# EAGLE design dashboard_controller (EAGLE 9.5.1)

## Sheet 1 of 2
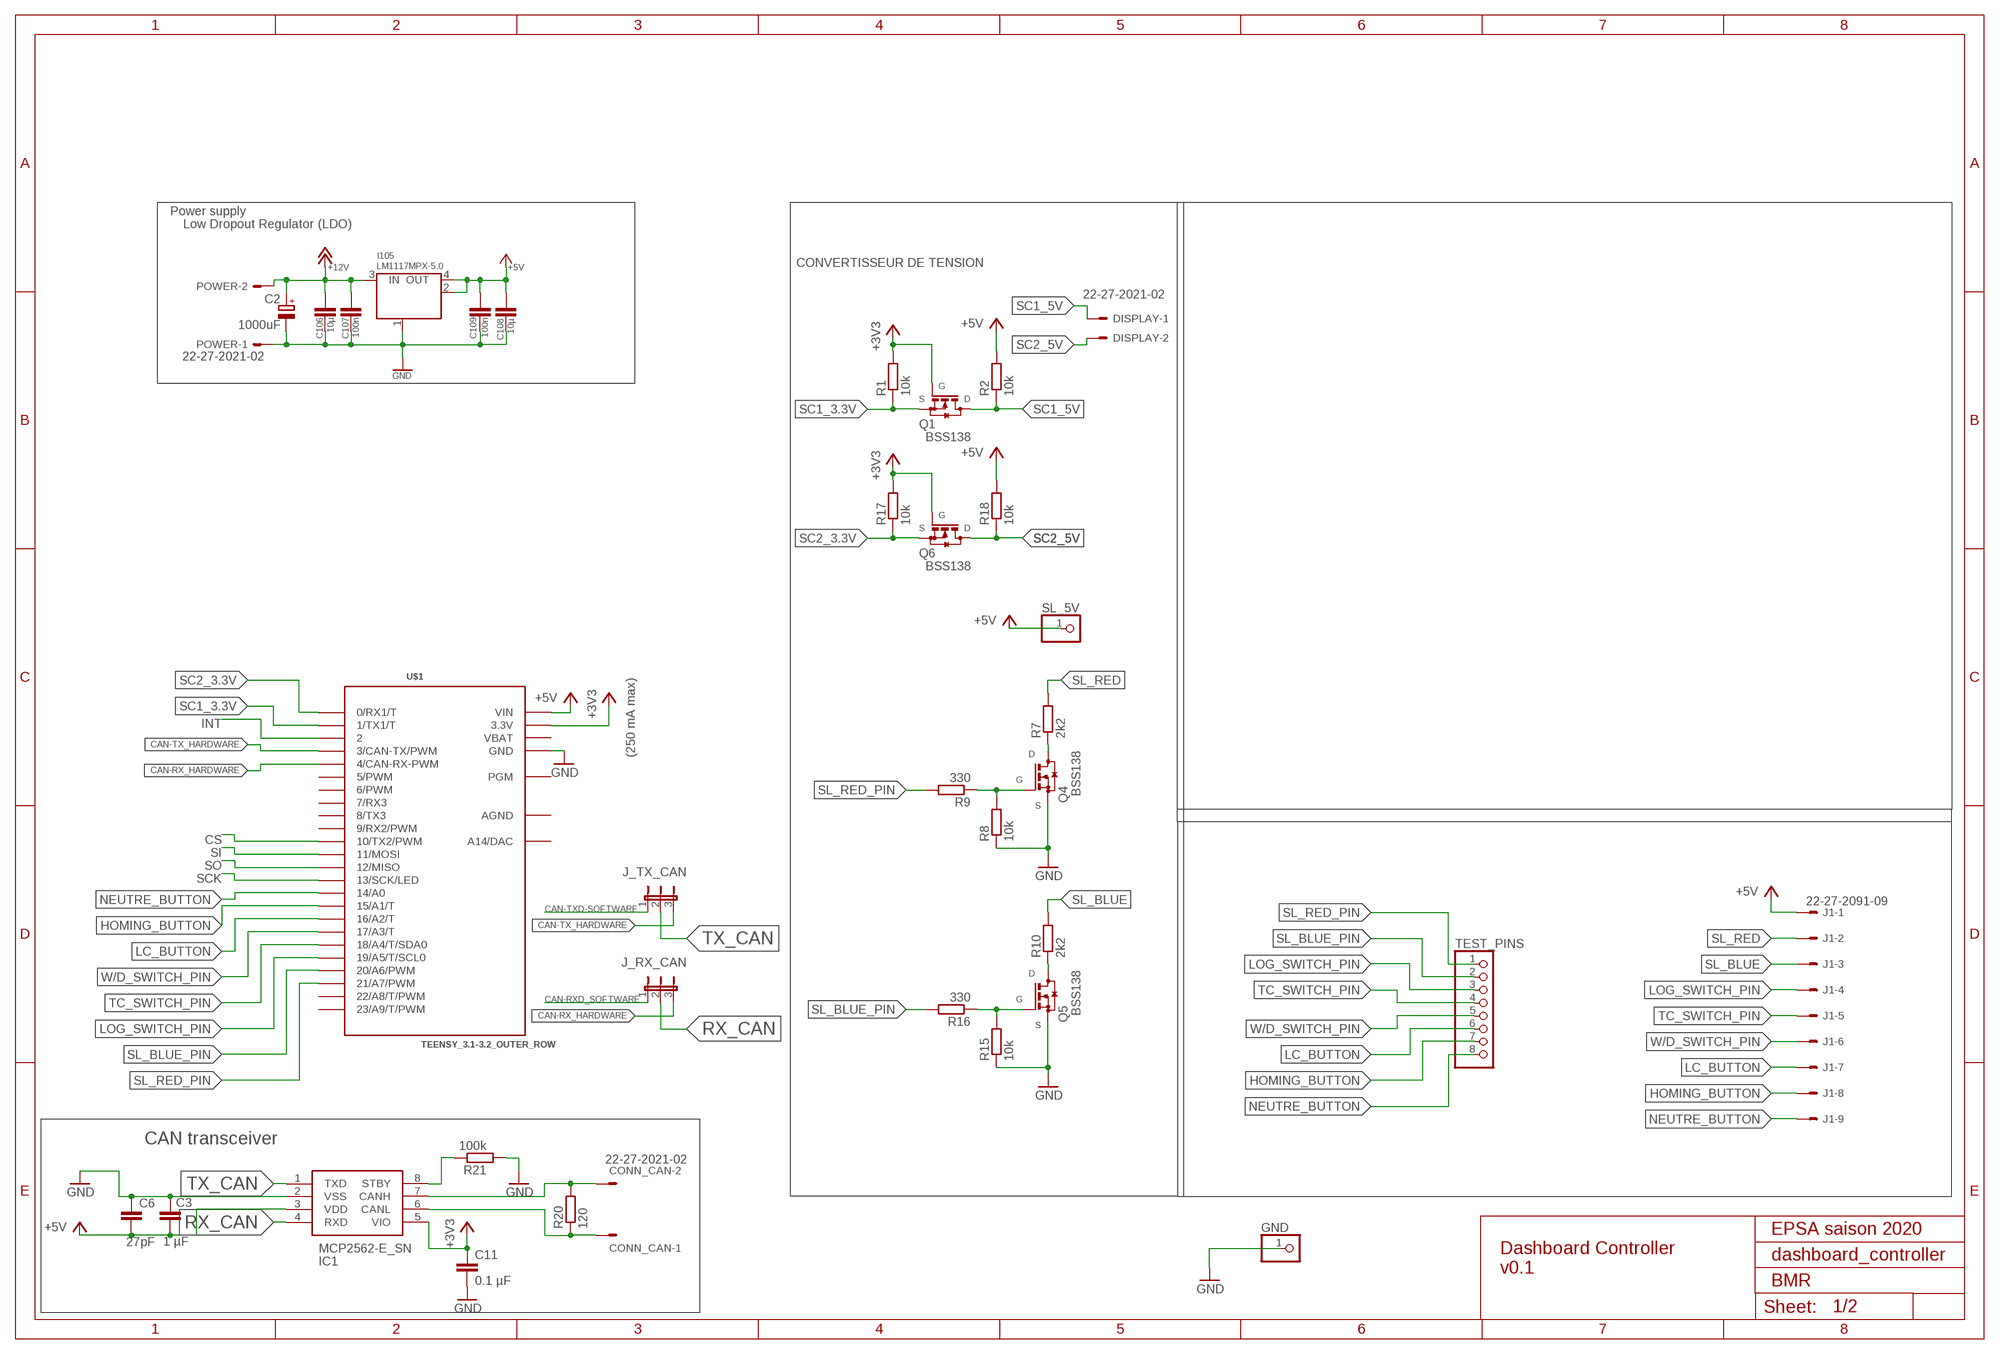
[diagram p0: schematic, sheet 1]

### Parts
C2  1000uF  CPOL-EUE25-10AXIAL  [E25-10]
C3  1 µF  C-EUC0805  [C0805]
C6  27pF  C-EUC0805  [C0805]
C11  0.1 µF  C-EUC0805  [C0805]
C106  10µ  C-EUC0805  [C0805]
C107  100n  C-EUC0603  [C0603]
C108  10µ  C-EUC0805  [C0805]
C109  100n  C-EUC0603  [C0603]
CONN_CAN  22-27-2021-02  [6410-02]
DISPLAY  22-27-2021-02  [6410-02]
GND  PINHD-1X1  [1X01]
I105  LM1117MPX-5.0  0022_LM1117IMPX-5.0  [LINEAR_SOT223]
IC1  MCP2562-E_SN  [SOIC127P600X175-8N]
J1  22-27-2091-09  [6410-09]
J_RX_CAN  JP2E  [JP2]
J_TX_CAN  JP2E  [JP2]
POWER  22-27-2021-02  [6410-02]
Q1  BSS138  BSS123  [SOT23]
Q4  BSS138  BSS123  [SOT23]
Q5  BSS138  BSS123  [SOT23]
Q6  BSS138  BSS123  [SOT23]
R1  10k  R-EU_R0805  [R0805]
R2  10k  R-EU_R0805  [R0805]
R7  2k2  R-EU_R0805  [R0805]
R8  10k  R-EU_R0805  [R0805]
R9  330  R-EU_R0805  [R0805]
R10  2k2  R-EU_R0805  [R0805]
R15  10k  R-EU_R0805  [R0805]
R16  330  R-EU_R0805  [R0805]
R17  10k  R-EU_R0805  [R0805]
R18  10k  R-EU_R0805  [R0805]
R20  120  R-EU_R0805  [R0805]
R21  100k  R-EU_R0805  [R0805]
SL_5V  PINHD-1X1  [1X01]
TEST_PINS  PINHD-1X8  [1X08]
U$1  TEENSY_3.1-3.2_OUTER_ROW  [TEENSY_3.0-3.2&LC_OUTER_ROW]

### Nets
+3V3: C11.1 IC1.5(VIO) Q1.1(G) Q6.1(G) R1.2 R17.2 U$1.3.3V U$1.3.3V1(3.3V) ; also sheet 2
+5V: C3.2 C6.2 C108.1 C109.2 I105.2(OUT) I105.4(OUT) IC1.3(VDD) J1.1 R2.2 R18.2 SL_5V.1 U$1.VIN
+12V: C2.+ C106.1 C107.1 I105.3(IN) POWER.2
CAN-RX_HARDWARE: J_RX_CAN.3 U$1.4(4/CAN-RX-PWM)
CAN-RXD_SOFTWARE: J_RX_CAN.1 ; also sheet 2
CAN-TX_HARDWARE: J_TX_CAN.3 U$1.3(3/CAN-TX/PWM)
CAN-TXD-SOFTWARE: J_TX_CAN.1 ; also sheet 2
CS: U$1.10(10/TX2/PWM) ; also sheet 2
GND: C2.- C3.1 C6.1 C11.2 C106.2 C107.2 C108.2 C109.1 GND.1 I105.1(GND/ADJ) IC1.2(VSS) POWER.1 Q4.2(S) Q5.2(S) R8.1 R15.1 R21.1 U$1.GND U$1.GND1(GND) ; also sheet 2
HOMING_BUTTON: J1.8 TEST_PINS.7 U$1.15/A1(15/A1/T)
INT: U$1.2 ; also sheet 2
LC_BUTTON: J1.7 TEST_PINS.6 U$1.16/A2(16/A2/T)
LOG_SWITCH_PIN: J1.4 TEST_PINS.3 U$1.19/A5(19/A5/T/SCL0)
N$1: CONN_CAN.2 IC1.7(CANH) R20.2
N$2: IC1.8(STBY) R21.2
N$4: Q4.3(D) R7.1
N$5: Q5.1(G) R15.2 R16.1
N$6: CONN_CAN.1 IC1.6(CANL) R20.1
N$8: Q4.1(G) R8.2 R9.1
N$9: Q5.3(D) R10.1
NEUTRE_BUTTON: J1.9 TEST_PINS.8 U$1.14/A0
RX_CAN: IC1.4(RXD) J_RX_CAN.2
SC1_3.3V: Q1.2(S) R1.1 U$1.1(1/TX1/T)
SC1_5V: DISPLAY.1 Q1.3(D) R2.1
SC2_3.3V: Q6.2(S) R17.1 U$1.0(0/RX1/T)
SC2_5V: DISPLAY.2 Q6.3(D) R18.1
SCK: U$1.13(13/SCK/LED) ; also sheet 2
SI: U$1.11(11/MOSI) ; also sheet 2
SL_BLUE: J1.3 R10.2
SL_BLUE_PIN: R16.2 TEST_PINS.2 U$1.20/A6(20/A6/PWM)
SL_RED: J1.2 R7.2
SL_RED_PIN: R9.2 TEST_PINS.1 U$1.21/A7(21/A7/PWM)
SO: U$1.12(12/MISO) ; also sheet 2
TC_SWITCH_PIN: J1.5 TEST_PINS.4 U$1.18/A4(18/A4/T/SDA0)
TX_CAN: IC1.1(TXD) J_TX_CAN.2
W/D_SWITCH_PIN: J1.6 TEST_PINS.5 U$1.17/A3(17/A3/T)
Unconnected: U$1.5(5/PWM) U$1.6(6/PWM) U$1.7(7/RX3) U$1.8(8/TX3) U$1.9(9/RX2/PWM) U$1.22/A8(22/A8/T/PWM) U$1.23/A9(23/A9/T/PWM) U$1.PGM U$1.RESET/DAC(A14/DAC)

### Notes on the sheet
- Power supply
- Low Dropout Regulator (LDO)
- CONVERTISSEUR DE TENSION
- G
- S | D
- G
- S | D
- (250 mA max) | D
- G
- S
- D
- G
- S
- CAN transceiver
- EPSA saison 2020
- Dashboard Controller
  v0.1
- BMR

## Sheet 2 of 2
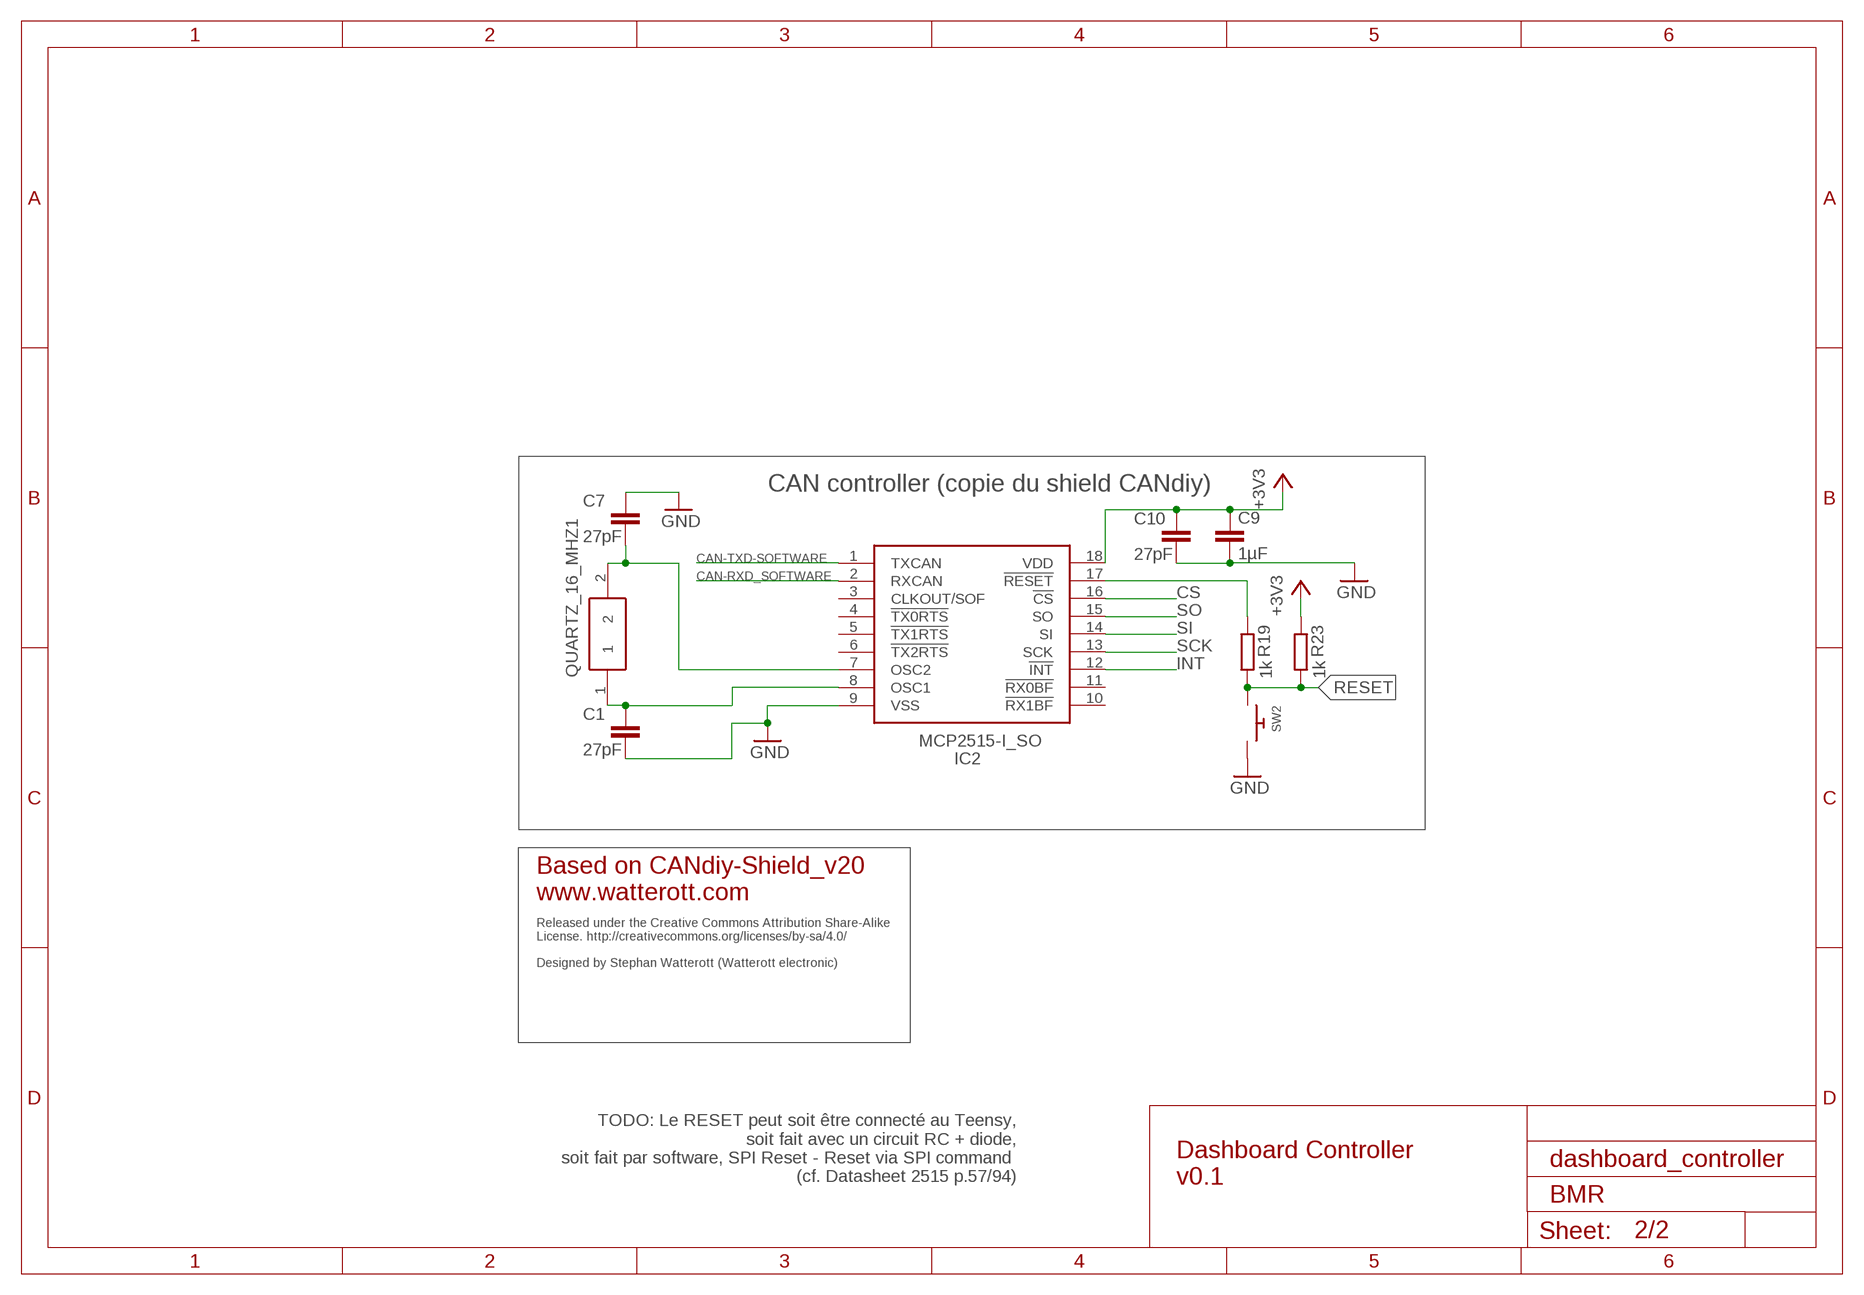
[diagram p1: schematic, sheet 2]

### Parts
C1  27pF  C-EUC0805  [C0805]
C7  27pF  C-EUC0805  [C0805]
C9  1µF  C-EUC0805  [C0805]
C10  27pF  C-EUC0805  [C0805]
IC2  MCP2515-I_SO  [SOIC127P1030X265-18N]
QUARTZ_16_MHZ1  FOXSLF_160-20  [HC49SLF_1]
R19  1k  R-EU_R0805  [R0805]
R23  1k  R-EU_R0805  [R0805]
SW2  SWITCH_PUSHBUTTONEVQ-PE  [TACT_PANA-EVQ]

### Nets
+3V3: C9.1 C10.1 IC2.18(VDD) R23.1 ; also sheet 1
CAN-RXD_SOFTWARE: IC2.2(RXCAN) ; also sheet 1
CAN-TXD-SOFTWARE: IC2.1(TXCAN) ; also sheet 1
CS: IC2.16(!CS) ; also sheet 1
GND: C1.2 C7.1 C9.2 C10.2 IC2.9(VSS) SW2.P$2 ; also sheet 1
INT: IC2.12(!INT) ; also sheet 1
N$3: C1.1 IC2.8(OSC1) QUARTZ_16_MHZ1.1
N$7: C7.2 IC2.7(OSC2) QUARTZ_16_MHZ1.2
N$11: IC2.17(!RESET) R19.1
RESET: R19.2 R23.2 SW2.P$1
SCK: IC2.13(SCK) ; also sheet 1
SI: IC2.14(SI) ; also sheet 1
SO: IC2.15(SO) ; also sheet 1
Unconnected: IC2.3(CLKOUT/SOF) IC2.4(!TX0RTS) IC2.5(!TX1RTS) IC2.6(!TX2RTS) IC2.10(!RX1BF) IC2.11(!RX0BF)

### Notes on the sheet
- CAN controller (copie du shield CANdiy)
- Based on CANdiy-Shield_v20
  www.watterott.com
- Released under the Creative Commons Attribution Share-Alike 
  License. http://creativecommons.org/licenses/by-sa/4.0/
  
  Designed by Stephan Watterott (Watterott electronic)
- TODO: Le RESET peut soit être connecté au Teensy,
   soit fait avec un circuit RC + diode,
   soit fait par software, SPI Reset - Reset via SPI command 
  (cf. Datasheet 2515 p.57/94)
- Dashboard Controller
  v0.1
- BMR

## Power pins joined to a net without a drawn wire
AGND: U$1.AGND
VBAT: U$1.VBAT

## Library data of the parts
C1 C3 C6 C7 C9-C11 C106 C108 = rcl:C-EU: CAPACITOR, European symbol; SPICEPREFIX: C
C2 = rcl:CPOL-EU: POLARIZED CAPACITOR, European symbol; SPICEPREFIX: C
C107 C109 = rcl:C-EU: CAPACITOR, European symbol
CONN_CAN DISPLAY POWER = con-molex:22-?-02: CONNECTOR wire to board 2.54 mm (.1 inch) pitch header; MF: MOLEX; OC_FARNELL: unknown; OC_NEWARK: unknown
GND SL_5V = pinhead:PINHD-1X1: PIN HEADER
I105 = IntegratedCircuits:0022_LM1117IMPX-5.0: Low-dropout linear regulator 5V -LM1117IMPX-5.0; CASE: SOT223; MONTHLY_USAGE: _____; PART_NUMBER: LM1117IMPX-5.0; PRICE: _____; SUPPLIER: _____; TYPE: Circuito_Integrato; VALUE: LM1117IMPX-5.0
IC1 = MCP2562-E_SN:MCP2562-E_SN: CAN Transceiver 1Mbps 5V 125degC SOIC8 CAN Transceiver 1MBps IEC 61000-4-2 Standby-Mode 8pins SOIC Source: Datasheet <http://uk.rs-online.com/web/p/products/7990228P>; ALLIED_NUMBER: 70415107; DESCRIPTION: CAN Transceiver 1Mbps 5V 125degC SOIC8 CAN Transceiver 1MBps IEC 61000-4-2 Standby-Mode 8pins SOIC; HEIGHT: 1.75mm; MANUFACTURER_NAME: Microchip; MANUFACTURER_PART_NUMBER: MCP2562-E/SN; RS_PART_NUMBER: 7990228P
IC2 = MCP2515-I_SO:MCP2515-I_SO: CAN Controller SPI data filtering SO18 Source: Datasheet <http://uk.rs-online.com/web/p/products/1445765>; ALLIED_NUMBER: 70045399; DESCRIPTION: CAN Controller SPI data filtering SO18; HEIGHT: 2.65mm; MANUFACTURER_NAME: Microchip; MANUFACTURER_PART_NUMBER: MCP2515-I/SO; RS_PART_NUMBER: 1445765
J1 = con-molex:22-?-09: CONNECTOR wire to board 2.54 mm (.1 inch) pitch header; MF: MOLEX; OC_FARNELL: unknown; OC_NEWARK: unknown
J_RX_CAN J_TX_CAN = jumper:JP2E: JUMPER
Q1 Q4-Q6 = transistor-small-signal:BSS123: N-CHANNEL MOS FET
QUARTZ_16_MHZ1 = FOXSLF_160-20:FOXSLF_160-20: Crystal 16.000MHz HC49S HC-49-SLF Crystal 16MHz, ??30ppm, 2-Pin Source: Datasheet <http://uk.rs-online.com/web/p/products/1734298>; DESCRIPTION: Crystal 16.000MHz HC49S HC-49-SLF Crystal 16MHz, ??30ppm, 2-Pin; HEIGHT: mm; MANUFACTURER_NAME: Fox; MANUFACTURER_PART_NUMBER: FOXSLF/160-20; RS_PART_NUMBER: 1734298
R1 R2 R7-R10 R15-R21 R23 = rcl:R-EU_: RESISTOR, European symbol; SPICEPREFIX: R
SW2 = adafruit:SWITCH_PUSHBUTTON: Buttons SOFTTOUCHSMD_SJ - Soft touch temporary push button (Super Junk Akihabara) Compatible with SKPMANE010 [Mouser: 688-SKPMAN] C&K_KSS = Digikey: KSS221GLFS
TEST_PINS = test_pin_DTA:PINHD-1X8: PIN HEADER
U$1 = Teensy_3_and_LC_Series_Boards_v1.4:TEENSY_3.1-3.2_OUTER_ROW: Footprint for Teensy 3.1 or 3.2 board using all pin connections on the outer perimeter

## Net classes
0 default: width 0.61 mm

## Board
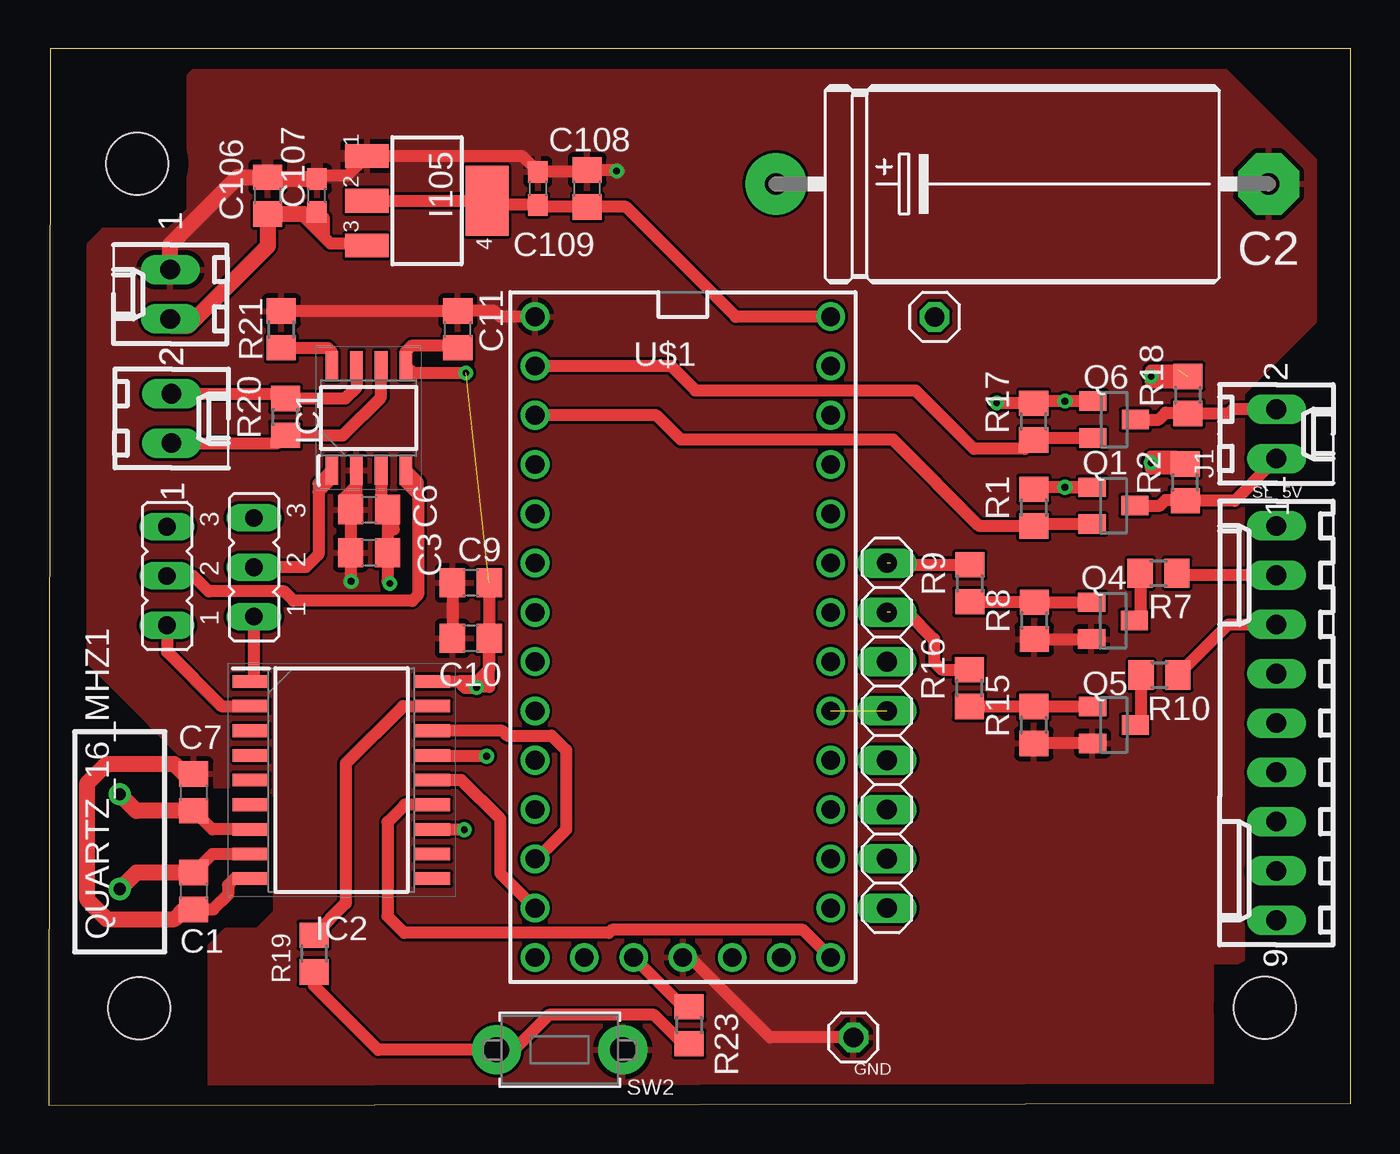
[diagram p2: board, top side]
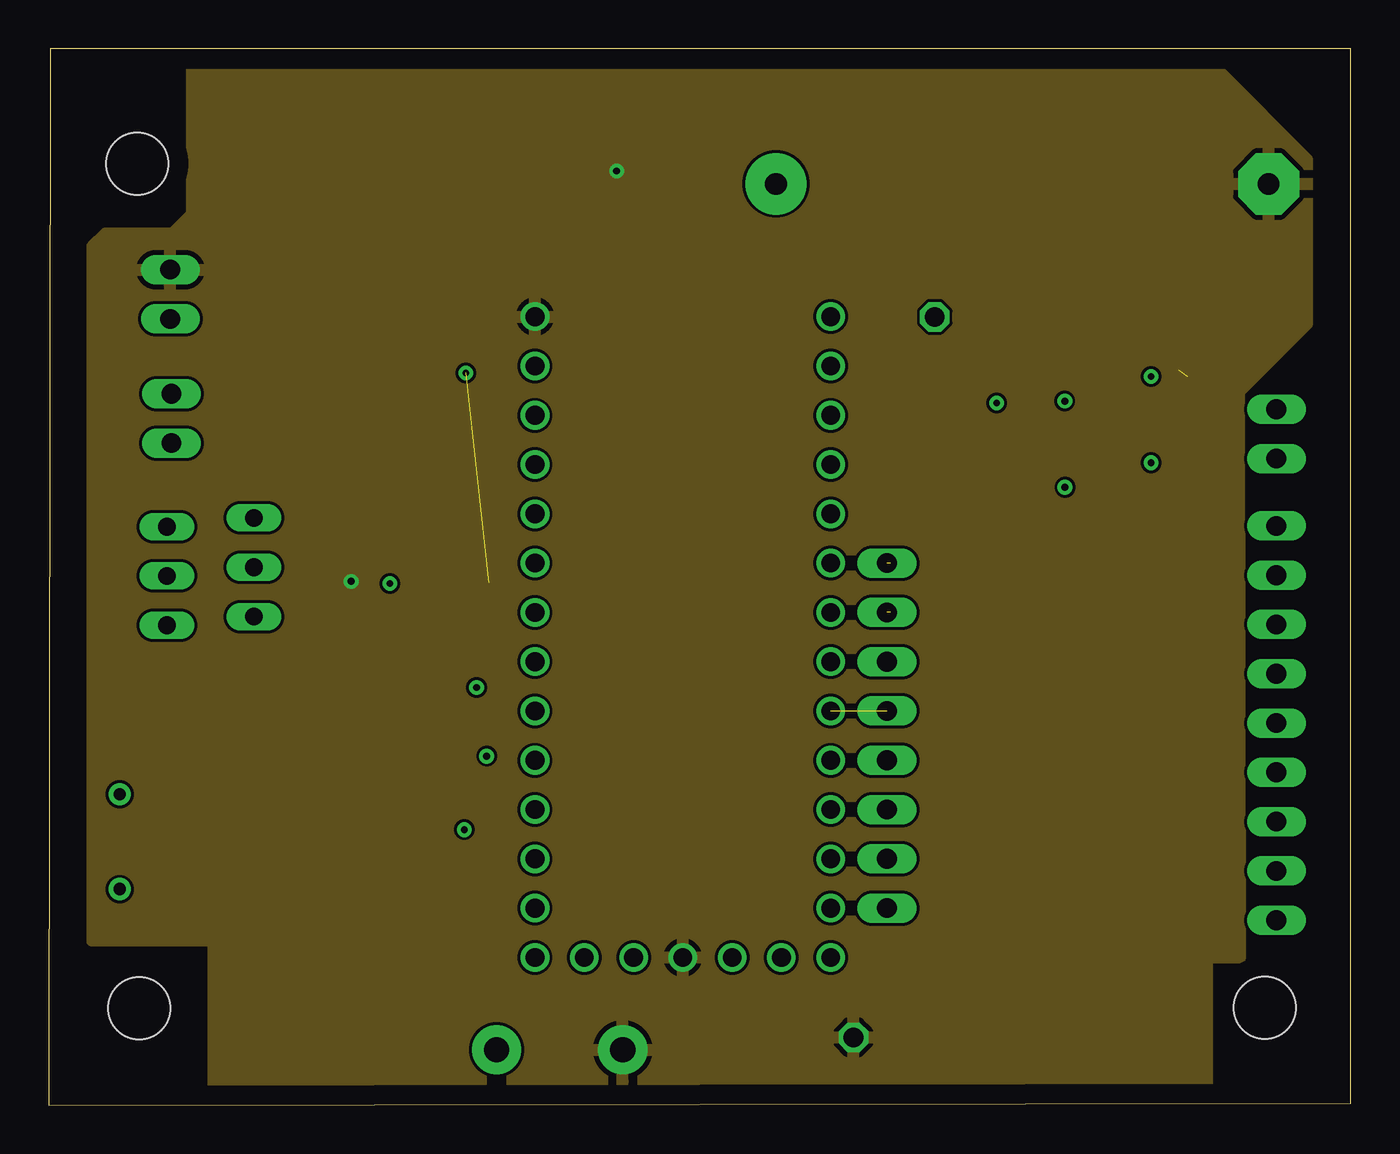
[diagram p3: board, inner layer Route2]
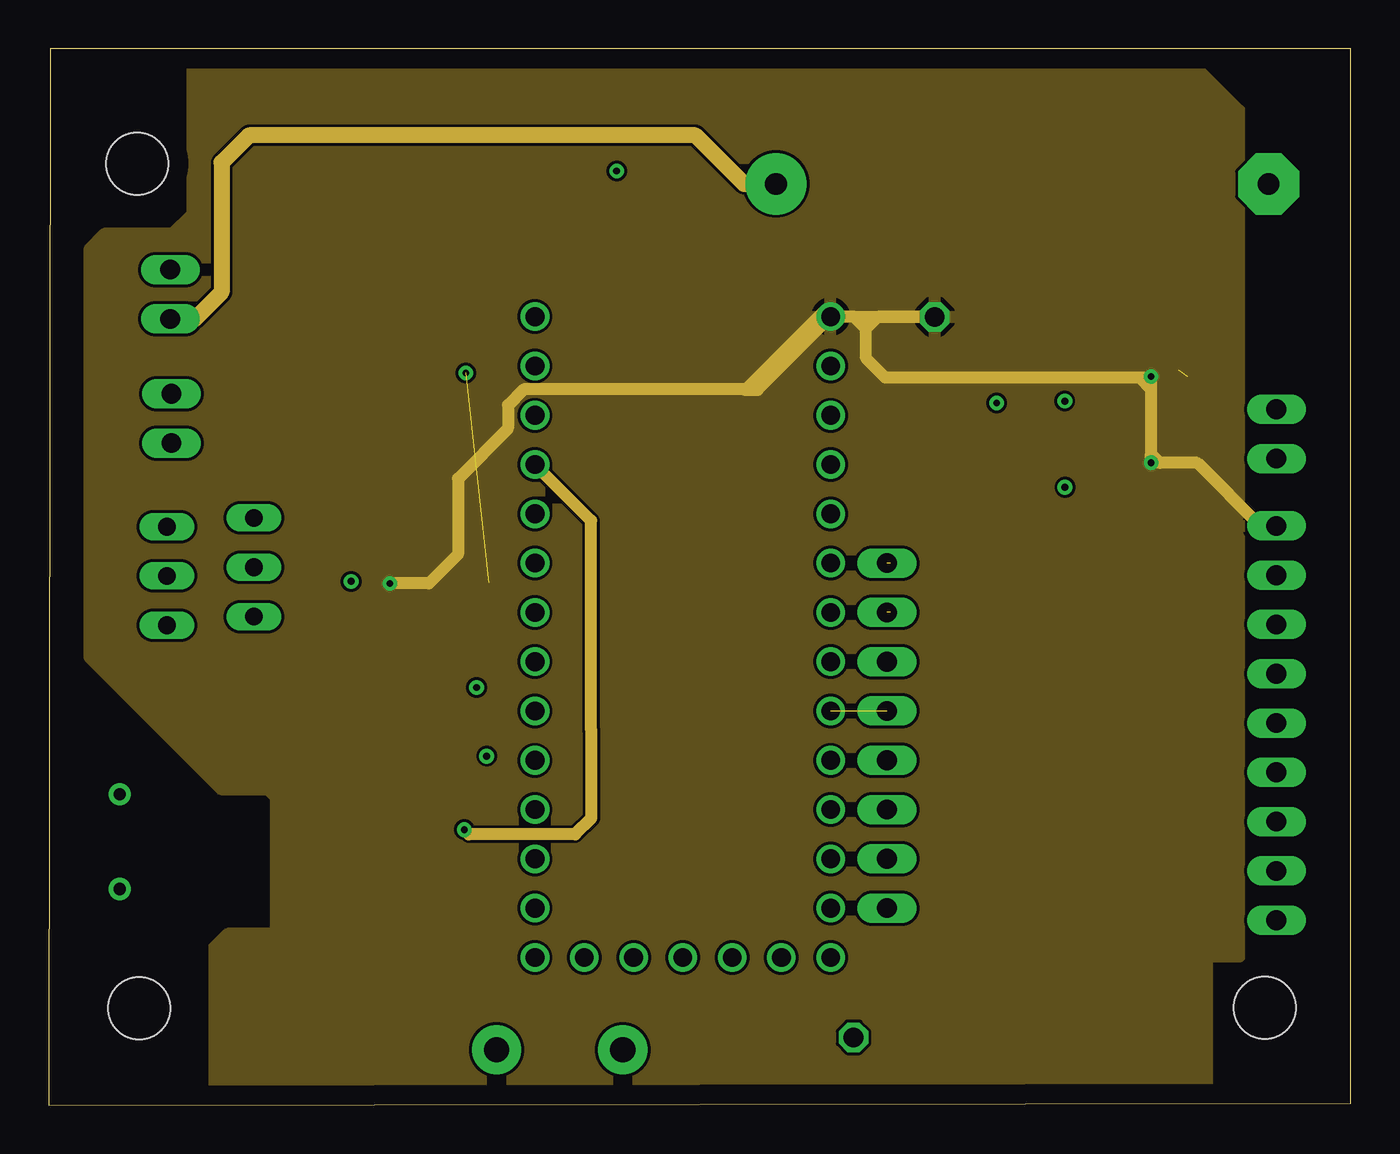
[diagram p4: board, inner layer Route15]
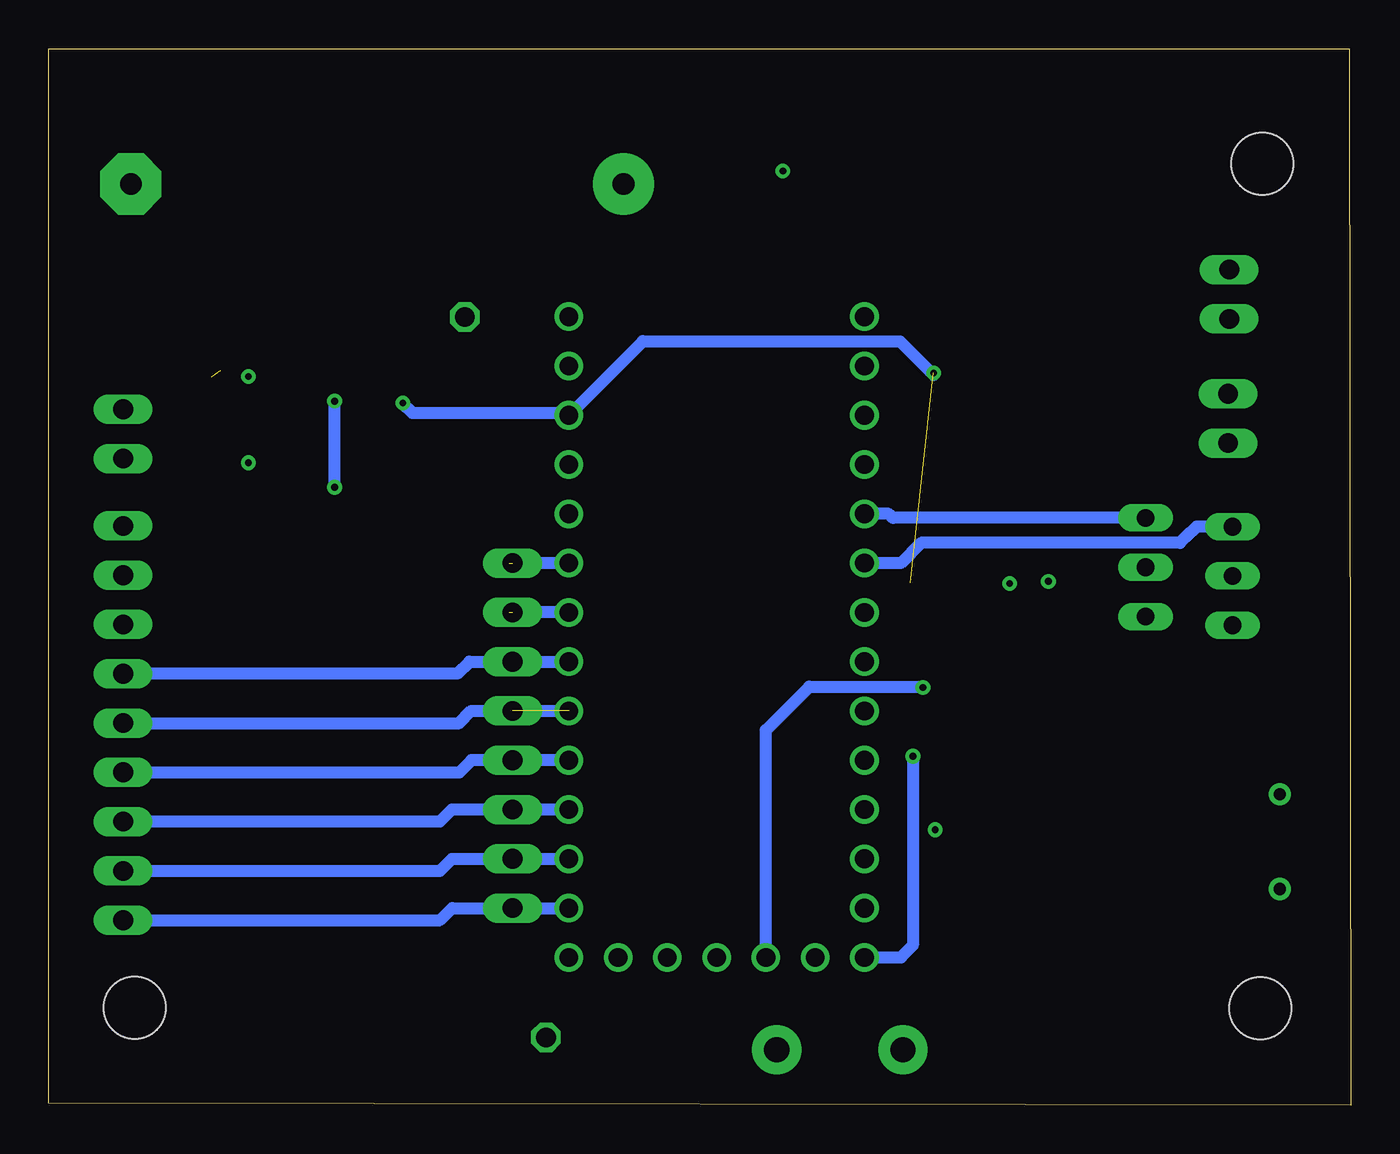
[diagram p5: board, bottom side, seen from below]

Size 67.15 x 54.46 mm. Coordinates in mm from the lower left corner, seen from the top.
Outline: 0,0 67.13,0.12 67.15,54.46 0.1,54.46 0,0
Copper layers (1+2*15+16): Top 0.035mm / dielectric 1.5mm / Route2 0.035mm / dielectric 0.15mm / Route15 0.035mm / dielectric 0.2mm / Bottom 0.035mm
Design rules "default *": minimum track width 6mil, minimum drill 0.35mm, track to track 6mil, track to pad 6mil, pad to pad 6mil, via to via 6mil, smd to smd 6mil, copper to edge 40mil, drill to drill 12mil, minimum pad ring 10mil, minimum via ring 8mil, stop-mask expansion 4mil, vias tented up to drill 0mil, thermal gap 10mil
Holes 3.2 mm at 4.67,5.01 62.7,5.01 4.58,48.52

### Footprints (pad centres in the part's own frame; a part is rotated, then mirrored left to right if it is on the bottom)
C0805 = smd 1.3 x 1.5: 1 -0.95,0; 2 0.95,0
E25-10 = drill 1.118 pad 3.15: + -12.7,0 | drill 1.118 pad 3.15 octagon: - 12.7,0
C0603 = smd 1.1 x 1: 1 -0.85,0; 2 0.85,0
6410-02 = drill 1.016 long: 1 1.27,0; 2 -1.27,0
1X01 = drill 1.016 octagon: 1 0,0
LINEAR_SOT223 = smd 1.219 x 2.235: 1 -2.311,-3.099; 2 0,-3.099; 3 2.311,-3.099 | smd 3.6 x 2.2: 4 0,3.099
SOIC127P600X175-8N = smd 1.5 x 0.65: 1 -2.7,1.905; 2 -2.7,0.635; 3 -2.7,-0.635; 4 -2.7,-1.905; 5 2.7,-1.905; 6 2.7,-0.635; 7 2.7,0.635; 8 2.7,1.905
SOIC127P1030X265-18N = smd 1.85 x 0.65: 1 -4.675,5.08; 2 -4.675,3.81; 3 -4.675,2.54; 4 -4.675,1.27; 5 -4.675,0; 6 -4.675,-1.27; 7 -4.675,-2.54; 8 -4.675,-3.81; 9 -4.675,-5.08; 10 4.675,-5.08; 11 4.675,-3.81; 12 4.675,-2.54; 13 4.675,-1.27; 14 4.675,0; 15 4.675,1.27; 16 4.675,2.54; 17 4.675,3.81; 18 4.675,5.08
6410-09 = drill 1.016 long: 1 10.16,0; 2 7.62,0; 3 5.08,0; 4 2.54,0; 5 0,0; 6 -2.54,0; 7 -5.08,0; 8 -7.62,0; 9 -10.16,0
JP2 = drill 0.914 long: 1 -2.54,0; 2 0,0; 3 2.54,0
SOT23 = smd 1 x 1.4: 1 -0.95,-1.1; 2 0.95,-1.1; 3 0,1.1
HC49SLF_1 = drill 0.63 pad 1.13: 1 -2.44,0; 2 2.44,0
R0805 = smd 1.3 x 1.5: 1 -0.95,0; 2 0.95,0
TACT_PANA-EVQ = drill 1.3 pad 2.54: P$1 -3.25,0; P$2 3.25,0
1X08 = drill 1.016 long: 1 -8.89,0; 2 -6.35,0; 3 -3.81,0; 4 -1.27,0; 5 1.27,0; 6 3.81,0; 7 6.35,0; 8 8.89,0
TEENSY_3.0-3.2&LC_OUTER_ROW = drill 0.965: 0 -7.62,13.97; 1 -7.62,11.43; 2 -7.62,8.89; 3 -7.62,6.35; 3.3V 7.62,11.43; 3.3V1 -2.54,-16.51; 4 -7.62,3.81; 5 -7.62,1.27; 6 -7.62,-1.27; 7 -7.62,-3.81; 8 -7.62,-6.35; 9 -7.62,-8.89; 10 -7.62,-11.43; 11 -7.62,-13.97; 12 -7.62,-16.51; 13 7.62,-16.51; 14/A0 7.62,-13.97; 15/A1 7.62,-11.43; 16/A2 7.62,-8.89; 17/A3 7.62,-6.35; 18/A4 7.62,-3.81; 19/A5 7.62,-1.27; 20/A6 7.62,1.27; 21/A7 7.62,3.81; 22/A8 7.62,6.35; 23/A9 7.62,8.89; AGND 7.62,13.97; GND -7.62,16.51; GND1 0,-16.51; PGM 2.54,-16.51; RESET/DAC 5.08,-16.51; VBAT -5.08,-16.51; VIN 7.62,16.51

### Placement (x,y rotation side)
C1  7.49,11.04 270 top
C2  50.2,47.48 0 top
C3  16.53,28.48 0 top
C6  16.53,30.7 0 top
C7  7.49,16.12 270 top
C9  21.77,26.92 180 top
C10  21.77,24.06 180 top
C11  21.1,39.98 90 top
C106  11.3,46.88 90 top
C107  13.85,46.88 90 top
C108  27.77,47.25 90 top
C109  25.23,47.25 270 top
CONN_CAN  6.34,35.4 270 top
DISPLAY  63.3,34.6 270 top
GND  41.5,3.5 180 top
I105  19.51,46.61 270 top
IC1  16.51,35.42 90 top
IC2  15.11,16.76 0 top
J1  63.3,19.7 90 top
J_RX_CAN  6.11,27.28 90 top
J_TX_CAN  10.59,27.73 90 top
POWER  6.28,41.8 90 top
Q1  54.9,30.9 270 top
Q4  54.88,24.98 270 top
Q5  54.92,19.6 270 top
Q6  54.93,35.34 270 top
QUARTZ_16_MHZ1  3.67,13.59 90 top
R1  50.8,30.8 90 top
R2  58.6,32.1 90 top
R7  57.23,27.43 0 top
R8  50.83,24.98 90 top
R9  47.5,26.9 90 top
R10  57.27,22.18 0 top
R15  50.8,19.6 90 top
R16  47.48,21.5 90 top
R17  50.79,35.23 90 top
R18  58.74,36.6 90 top
R19  13.69,7.82 270 top
R20  12.22,35.48 90 top
R21  12,39.98 270 top
R23  33.02,4.13 270 top
SL_5V  45.69,40.63 180 top
SW2  26.35,2.86 0 top
TEST_PINS  43.23,19.05 270 top
U$1  32.7,24.13 0 top

### Tracks (layer width: path | path; a pad name or v marks a point on that pad's centre or on a via)
+3V3  (via drill 0.35)  (1 unrouted)
  Top 0.61: C11.1 21,39.13 18.71,39.13 18.41,38.84 IC1.5 18.79,37.74 v21.52,37.74 | v48.88,36.19 R17.2 50.89,36.28 v52.4,36.28 | C9.1 C10.1 | IC2.18 21.14,21.84 | R23.1 32.7,5.08 U$1.3.3V1 | 22.72,21.84 C10.1 | 21.14,21.84 21.48,21.5 22.03,21.5 v22.07,21.54 v22.08,21.54 22.11,21.57 22.73,21.57 22.73,21.84 22.72,21.84 | 22.09,21.84 21.14,21.84 | C10.1 22.72,22.47 22.09,21.84 | 22.72,21.84 22.09,21.84 | Q6.1 v52.4,36.28 | v52.39,36.29 v52.4,36.29 v52.4,36.28 | R1.2 50.9,31.85 Q1.1 v52.4,31.85
  Bottom 0.61: v48.88,36.19 48.38,35.69 40.45,35.69 U$1.3.3V 36.5,39.38 36.5,39.36 23.24,39.36 21.52,37.64 v21.52,37.74 | U$1.3.3V1 30.16,19.34 27.93,21.57 22.11,21.57 v22.07,21.54 | v52.4,31.85 v52.4,36.28 v52.39,36.29
+5V  (via drill 0.35)  (1 unrouted)
  Top 0.61: IC1.3 17.14,30.97 17.78,30.34 17.78,29.7 | 17.8,29.68 17.78,29.7 | 17.78,29.7 17.48,30 C6.2 C3.2 17.48,27.01 v17.6,26.89 | I105.2 I105.4 22.61,46.46 22.67,46.4 C109.2 25.33,46.3 C108.1 29.77,46.3 35.44,40.63 35.43,40.64 U$1.VIN | 58.27,37.88 56.84,37.88 56.84,37.24 58.17,37.24 | 58.43,33.11 58.11,33.43 56.84,33.43 v56.84,33.11 | 58.43,32.8 56.84,32.8 | 56.84,32.8 v56.84,33.11 | 57.15,33.11 56.84,32.8 | v56.84,33.11 56.9,33.05 R2.2 | v56.84,37.56 R18.2
  Route15 0.61: U$1.VIN 40.93,40.64 | 56.84,33.58 v56.84,33.11 57.3,33.11 | 56.84,37.5 v56.84,37.56 56.84,37.46 | v17.6,26.89 19.61,26.89 21.1,28.39 21.1,32.3 23.69,34.89 23.69,36.09 24.5,36.9 35.95,36.9 | U$1.VIN 36.55,36.87 35.92,36.87 35.95,36.9 | 42.14,40.02 42.14,38.5 43.14,37.5 56.25,37.5 | 42.14,40.02 41.52,40.64 | 41.52,40.64 U$1.VIN | 56.84,37.5 56.84,36.91 | 56.84,36.91 56.84,33.58 | 56.84,37.5 56.25,37.5 | 40.01,40.96 35.95,36.9 | 57.3,33.11 59.21,33.11 62.48,29.85 J1.1 | 56.84,33.58 57.3,33.11 | 56.25,37.5 56.84,36.91 | SL_5V.1 45.62,40.56 | 41.52,40.64 SL_5V.1 | SL_5V.1 42.75,40.63 42.14,40.02
  pour Route15: 2.1,23.09 8.9,16.29 11.3,16.29 11.72,15.87 11.72,8.92 11.64,8.84 9.24,8.84 8.54,8.14 8.54,1.16 59.55,1.04 59.55,1.01 59.73,1.01 59.73,7.67 61.39,7.67 61.39,51.26 58.66,53.99 7.4,53.6 7.4,45.9 6.41,44.91 2.87,44.91 2.1,44.11
+12V
  Top 0.61: 13.63,45.75 14.18,45.75 14.18,45.21 | 14.18,44.77 14.53,44.42 16.3,44.42 I105.3 | 14.18,45.21 13.63,45.75 | 13.45,45.93 13.17,45.93 13.17,45.78 14.18,44.77 | 13.45,45.93 13.63,45.75 | 13.45,45.93 14,45.93 13.9,46.03 C107.1 | 14.18,45.21 14.18,44.77
  Top 0.813: 13.17,45.93 C106.1 11.3,44.27 7.21,40.18 6.28,40.18 POWER.2
  Route15 0.813: C2.+ 35.86,47.48 33.35,49.99 10.34,49.99 8.93,48.58 8.93,41.9 7.55,40.53 POWER.2
CAN-RX_HARDWARE
  Bottom 0.61: U$1.4 23.21,27.94 22.16,28.99 8.82,28.99 8.49,29.32 7.97,29.82 J_RX_CAN.3
CAN-RXD_SOFTWARE
  Top 0.61: J_RX_CAN.1 6.11,23.37 8.91,20.57 IC2.2
CAN-TX_HARDWARE
  Bottom 0.61: U$1.3 23.82,30.48 23.61,30.27 23.6,30.27 J_TX_CAN.3
CAN-TXD-SOFTWARE
  Top 0.61: J_TX_CAN.1 10.59,22 IC2.1
CS
  Top 0.61: U$1.10 25.18,12.7 26.68,14.2 26.68,18.3 25.93,19.05 23.65,19.05 23.4,19.3 IC2.16
GND  (via drill 0.35)
  Top 0.61: 15.88,30.97 15.88,31.61 | 15.88,31.61 IC1.2 15.88,31.93 15.56,31.61 | 11.4,47.73 C106.2 | C9.2 C10.2 | 15.56,31.61 15.24,31.29 15.24,31.04 C6.1 C3.1 15.58,27.02 v15.6,27 | 15.56,31.61 15.88,31.61 | v29.29,48.15 29.25,48.19 27.78,48.19 C108.2 27.67,48.1 C109.1 24.4,48.92 I105.1 15.41,47.92 14.17,47.92 13.98,47.73 C107.2 | 7,17.07 C7.1 | 7,10.1 C1.2 8.5,10.1 9.25,10.85 9.25,11.35 9.58,11.68 IC2.9 | 32.72,7.6 U$1.GND1 33.08,7.62 37.2,3.5 GND.1 | R8.1 Q4.2 | Q5.2 R15.1 | C11.2 20.71,40.94 | C11.2 21.09,40.92 R21.1 | C11.2 22.98,40.94 23.27,40.64 U$1.GND
  Top 0.813: C106.2 9.76,47.83 6.28,44.35 POWER.1 | C107.2 11.4,47.73 | 7,17.07 6.47,17.6 3,17.6 2,16.6 2,10.6 3,9.6 6.5,9.6 7,10.1
  pour Top: 2.1,44.33 2.1,22.85 8.45,16.5 11.2,16.5 11.7,16 11.7,9.91 10.79,9 9.17,9 8.33,8.16 8.33,0.96 59.94,0.96 59.94,7.42 61.55,7.42 61.55,36.72 65.25,40.42 65.25,48.68 60.28,53.65 7.9,53.65 7.25,53 7.25,46.1 6.22,45.07 2.84,45.07
  pour Route2: 60.37,53.25 7.38,53.25 7.38,45.92 6.38,44.92 2.94,44.92 2.25,44.23 2.25,8.5 8.48,8.5 8.48,1.06 59.73,1.06 59.73,7.62 61.43,7.62 61.4,36.78 64.89,40.27 64.89,48.73
  pour Top: 16.52,48.97 16.37,49.12 9.03,49.12 7.73,47.82 15.32,47.82 16.47,48.97
HOMING_BUTTON
  Bottom 0.61: J1.8 46.97,12.08 46.35,12.7 TEST_PINS.7 U$1.15/A1
INT  (via drill 0.35)
  Top 0.61: IC2.12 21.42,14.22 v21.44,14.2
  Route15 0.61: U$1.2 27.98,30.13 27.98,19.33 27.99,19.32 27.99,14.8 27.16,13.96 21.68,13.96 v21.44,14.2
LC_BUTTON
  Bottom 0.61: U$1.16/A2 TEST_PINS.6 46.36,15.24 46.98,14.62 J1.7
LOG_SWITCH_PIN
  Bottom 0.61: J1.4 46.08,22.24 45.45,22.86 TEST_PINS.3 40.33,22.86 U$1.19/A5
N$1
  Top 0.61: IC1.7 15.88,37 15.3,36.43 R20.2 11.98,36.66 CONN_CAN.2
N$2
  Top 0.61: R21.2 14.4,39.03 14.59,38.84 IC1.8
N$3
  Top 0.61: IC2.8 8.44,12.95 C1.1
  Top 0.813: C1.1 4.53,11.99 QUARTZ_16_MHZ1.1
N$4
  Top 0.61: R7.1 56.27,25.27 Q4.3
N$5
  Top 0.61: Q5.1 R15.2 R16.1
N$6
  Top 0.61: IC1.6 17.14,36.5 15.17,34.53 R20.1 11.81,34.12 CONN_CAN.1
N$7
  Top 0.61: IC2.7 8.44,14.22 C7.2
  Top 0.813: C7.2 4.53,15.18 QUARTZ_16_MHZ1.2
N$8
  Top 0.61: Q4.1 R8.2 47.62,25.93 R9.1
N$9
  Top 0.61: R10.1 56.33,19.9 Q5.3
N$11
  Top 0.61: R19.1 15.33,10.4 15.33,17.62 18.28,20.57 IC2.17
NEUTRE_BUTTON
  Bottom 0.61: U$1.14/A0 40.33,10.16 TEST_PINS.8 46.34,10.16 46.96,9.54 J1.9
RESET
  Top 0.61: R23.2 32.7,3.18 31.21,4.66 25.8,4.66 24,2.86 SW2.P$1 17,2.86 13.69,6.17 R19.2
RX_CAN
  Top 0.61: 19.05,31.47 19.05,32.11 18.44,32.72 IC1.4 18.41,32.11 19.05,31.47 | 19.05,31.47 19.05,26.3 18.75,26 12.64,26 12.15,26.49 8.26,26.49 7.47,27.28 J_RX_CAN.2
SC1_3.3V
  Top 0.61: Q1.2 50.9,29.95 R1.1 48,29.85 43.55,34.3 32.6,34.3 31.34,35.56 U$1.1
SC1_5V
  Top 0.61: R2.1 59,31.15 58.95,31.2 57.6,31.2 57.3,30.9 Q1.3 | 58.65,31.1 R2.1 | R2.1 61.15,31.15 62.1,32.1 62.1,32.13 DISPLAY.1
SC2_3.3V
  Top 0.61: Q6.2 50.89,34.38 R17.1 50.34,33.83 47.72,33.83 44.7,36.85 33.35,36.85 32.09,38.1 U$1.0
SC2_5V
  Top 0.61: DISPLAY.2 61.07,35.87 60.85,35.66 R18.1 58.7,35.7 57.6,35.7 57.23,35.34 Q6.3
SCK
  Top 0.61: IC2.13 18.38,15.49 17.48,14.59 17.48,9.75 18.34,8.88 28.89,8.88 28.89,8.89 29.05,9.04 38.9,9.04 U$1.13
SI
  Top 0.61: U$1.11 23.28,11.96 23.28,14.76 21.28,16.76 IC2.14
SL_BLUE
  Top 0.61: 58.3,22.25 R10.2 60.83,24.78 J1.3
SL_BLUE_PIN  (1 unrouted)
  Top 0.61: R16.2 46.05,22.45 45.65,22.85 45.65,24.02 44.27,25.41 TEST_PINS.2
  Bottom 0.61: U$1.20/A6 43.4,25.4
SL_RED
  Top 0.61: J1.2 58.28,27.32 R7.2
SL_RED_PIN  (1 unrouted)
  Top 0.61: R9.2 44.3,27.85 44.21,27.94 TEST_PINS.1
  Bottom 0.61: U$1.21/A7 43.4,27.94
SO  (via drill 0.35)
  Top 0.61: v22.59,17.99 19.79,17.99 19.78,18 IC2.15
  Bottom 0.61: v22.59,17.99 22.59,8.23 23.2,7.62 U$1.12
TC_SWITCH_PIN  (1 unrouted)
  Bottom 0.61: J1.5 45.98,19.7 45.35,20.32 43.4,20.32 U$1.18/A4
TX_CAN
  Top 0.61: 13.92,31.61 13.92,28.39 13.26,27.73 J_TX_CAN.2 | 13.92,31.61 13.92,32.03 IC1.1 14.61,32.29 13.92,31.61
W/D_SWITCH_PIN
  Bottom 0.61: J1.6 45.97,17.16 45.34,17.79 45.34,17.78 TEST_PINS.5 U$1.17/A3

### Text on the board
tValues: 5V | SL_RED | SL_BLUE | LOG | TC | W/D | LAUNCH | HOMING | NEUTRE | Dashboard_controller / INVICTUS